# Altium schematic sheet ACCELEROMETER.SchDoc
size A; SheetNumber: 11; SheetTotal: 21
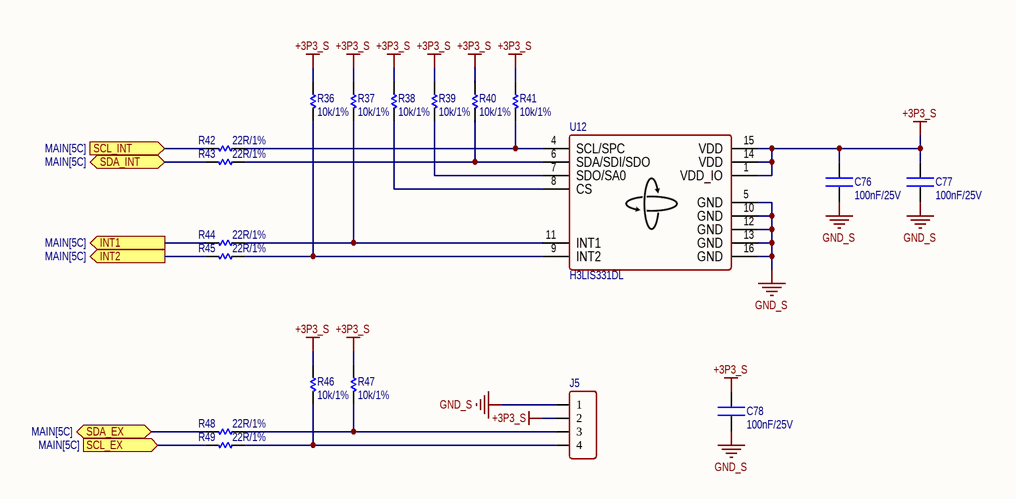
[diagram p0: ACCELEROMETER.SchDoc]

## Parts
C76  100nF/25V  [CN-SMD-0603]
C77  100nF/25V  [CN-SMD-0603]
C78  100nF/25V  [CN-SMD-0603]
J5  SM04B-SRSS-TBLFSN  [BM04B-SRSS-TB]  (value not drawn)
R36  10k/1%  [RES-SMD-0603]
R37  10k/1%  [RES-SMD-0603]
R38  10k/1%  [RES-SMD-0603]
R39  10k/1%  [RES-SMD-0603]
R40  10k/1%  [RES-SMD-0603]
R41  10k/1%  [RES-SMD-0603]
R42  22R/1%  [RES-SMD-0603]
R43  22R/1%  [RES-SMD-0603]
R44  22R/1%  [RES-SMD-0603]
R45  22R/1%  [RES-SMD-0603]
R46  10k/1%  [RES-SMD-0603]
R47  10k/1%  [RES-SMD-0603]
R48  22R/1%  [RES-SMD-0603]
R49  22R/1%  [RES-SMD-0603]
U12  H3LIS331DL  [TFLGA-16L]

## Ports
INT1 (out, see MAIN[5C]), INT2 (out, see MAIN[5C]), SCL_EX (in, see MAIN[5C]), SCL_INT (in, see MAIN[5C]), SDA_EX (bidir, see MAIN[5C]), SDA_INT (bidir, see MAIN[5C])

## Nets
+3P3_S: C76.2 C77.2 C78.2 J5.2 R36.1 R37.1 R38.1 R39.1 R40.1 R41.1 R46.1 R47.1 U12.1(VDD_IO) U12.14(VDD) U12.15(VDD)
GND_S: C76.1 C77.1 C78.1 J5.1 U12.5(GND) U12.10(GND) U12.12(GND) U12.13(GND) U12.16(GND)
INT1: R44.2 ; port INT1
INT2: R45.2 ; port INT2
SCL_EX: R49.2 ; port SCL_EX
SCL_INT: R42.2 ; port SCL_INT
SDA_EX: R48.2 ; port SDA_EX
SDA_INT: R43.2 ; port SDA_INT
NetJ5_3: J5.3 R47.2 R48.1
NetJ5_4: J5.4 R46.2 R49.1
NetR36_2: R36.2 R45.1 U12.9(INT2)
NetR37_2: R37.2 R44.1 U12.11(INT1)
NetR38_2: R38.2 U12.8(CS)
NetR39_2: R39.2 U12.7(SDO/SA0)
NetR40_2: R40.2 R43.1 U12.6(SDA/SDI/SDO)
NetR41_2: R41.2 R42.1 U12.4(SCL/SPC)

## Library data of the parts
C76-C78 = CN: CL10B104KA8NNNC; PN: CL10B104KA8NNNC
J5 = Header4: ComponentLink1 Description: Manufacturer; ComponentLink2 Description: Datasheet; ComponentLink1URL: http://www.we-online.com; ComponentLink2URL: http://katalog.we-online.de/em/datasheet/6130xx143121.pdf; PN: SM04B-SRSS-TBLFSN
R36-R41 R46 R47 = Res-SMD: ERJ-3EKF1002V; Manufacturer: Generic Components; Class: Passive; PN: ERJ-3EKF1002V; Publisher: Altium Hobart Technology Centre
R42-R45 R48 R49 = Res-SMD: ERJ-3EKF22R0V; PN: ERJ-3EKF22R0V
U12 = H3LIS331DL: High-g, low-power 3-axis digital accelerometer; PN: H3LIS331DL